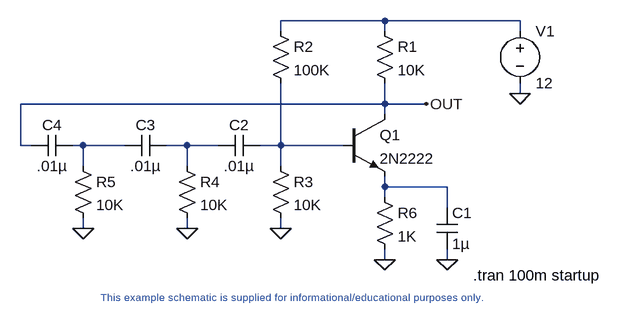
[diagram p0: schematic phaseshift.asc]
phaseshift.asc, the LTspice schematic file:
Version 4
SHEET 1 2252 2552
WIRE 1856 2032 1696 2032
WIRE 2064 2032 1856 2032
WIRE 1696 2048 1696 2032
WIRE 1856 2048 1856 2032
WIRE 2064 2048 2064 2032
WIRE 2064 2144 2064 2128
WIRE 1856 2160 1856 2128
WIRE 1856 2160 1296 2160
WIRE 1920 2160 1856 2160
WIRE 1856 2176 1856 2160
WIRE 1296 2224 1296 2160
WIRE 1312 2224 1296 2224
WIRE 1392 2224 1376 2224
WIRE 1456 2224 1392 2224
WIRE 1552 2224 1520 2224
WIRE 1600 2224 1552 2224
WIRE 1696 2224 1696 2128
WIRE 1696 2224 1664 2224
WIRE 1792 2224 1696 2224
WIRE 1392 2256 1392 2224
WIRE 1552 2256 1552 2224
WIRE 1696 2256 1696 2224
WIRE 1856 2288 1856 2272
WIRE 1952 2288 1856 2288
WIRE 1856 2304 1856 2288
WIRE 1952 2320 1952 2288
WIRE 1392 2352 1392 2336
WIRE 1552 2352 1552 2336
WIRE 1696 2352 1696 2336
WIRE 1856 2400 1856 2384
WIRE 1952 2400 1952 2384
FLAG 1856 2400 0
FLAG 1952 2400 0
FLAG 1696 2352 0
FLAG 1552 2352 0
FLAG 1392 2352 0
FLAG 2064 2144 0
FLAG 1920 2160 OUT
SYMBOL npn 1792 2176 R0
SYMATTR InstName Q1
SYMATTR Value 2N2222
SYMBOL res 1840 2032 R0
SYMATTR InstName R1
SYMATTR Value 10K
SYMBOL res 1680 2032 R0
SYMATTR InstName R2
SYMATTR Value 100K
SYMBOL res 1680 2240 R0
SYMATTR InstName R3
SYMATTR Value 10K
SYMBOL res 1536 2240 R0
SYMATTR InstName R4
SYMATTR Value 10K
SYMBOL res 1376 2240 R0
SYMATTR InstName R5
SYMATTR Value 10K
SYMBOL cap 1936 2320 R0
SYMATTR InstName C1
SYMATTR Value 1µ
SYMBOL cap 1664 2208 R90
WINDOW 0 0 32 VBottom 2
WINDOW 3 32 32 VTop 2
SYMATTR InstName C2
SYMATTR Value .01µ
SYMBOL res 1840 2288 R0
SYMATTR InstName R6
SYMATTR Value 1K
SYMBOL cap 1520 2208 R90
WINDOW 0 0 32 VBottom 2
WINDOW 3 32 32 VTop 2
SYMATTR InstName C3
SYMATTR Value .01µ
SYMBOL cap 1376 2208 R90
WINDOW 0 0 32 VBottom 2
WINDOW 3 32 32 VTop 2
SYMATTR InstName C4
SYMATTR Value .01µ
SYMBOL voltage 2064 2032 R0
SYMATTR InstName V1
SYMATTR Value 12
TEXT 1992 2424 Left 2 !.tran 100m startup
TEXT 1704 2448 Top 1 ;This example schematic is supplied for informational/educational purposes only.

The netlist it stands for:
* phaseshift.asc
Q1 OUT N004 N005 0 2N2222
R1 N001 OUT 10K
R2 N001 N004 100K
R3 N004 0 10K
R4 N003 0 10K
R5 N002 0 10K
C1 N005 0 1µ
C2 N004 N003 .01µ
R6 N005 0 1K
C3 N003 N002 .01µ
C4 N002 OUT .01µ
V1 N001 0 12
.model NPN NPN
.model PNP PNP
.lib standard.bjt
.tran 100m startup
* This example schematic is supplied for informational/educational purposes only.
.backanno
.end